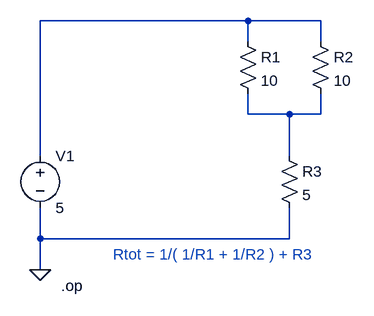
[diagram p0: schematic SeriesParallel circuit.asc]
SeriesParallel circuit.asc, the LTspice schematic file:
Version 4
SHEET 1 880 680
WIRE 320 144 0 144
WIRE 432 144 320 144
WIRE 320 176 320 144
WIRE 432 176 432 144
WIRE 320 288 320 256
WIRE 384 288 320 288
WIRE 432 288 432 256
WIRE 432 288 384 288
WIRE 0 352 0 144
WIRE 384 352 384 288
WIRE 0 480 0 432
WIRE 384 480 384 432
WIRE 384 480 0 480
WIRE 0 528 0 480
FLAG 0 528 0
SYMBOL voltage 0 336 R0
SYMATTR InstName V1
SYMATTR Value 5
SYMBOL res 304 160 R0
SYMATTR InstName R1
SYMATTR Value 10
SYMBOL res 416 160 R0
SYMATTR InstName R2
SYMATTR Value 10
SYMBOL res 368 336 R0
SYMATTR InstName R3
SYMATTR Value 5
TEXT 112 504 Left 2 ;Rtot = 1/( 1/R1 + 1/R2 ) + R3
TEXT 32 552 Left 2 !.op

The netlist it stands for:
* SeriesParallel circuit.asc
V1 N001 0 5
R1 N001 N002 10
R2 N001 N002 10
R3 N002 0 5
* Rtot = 1/( 1/R1 + 1/R2 ) + R3
.op
.backanno
.end